# Altium schematic sheet Draft.SchDoc
size A4; Author: ALTIUM GOSTBOM2.0 KEV; SheetNumber: 2; SheetTotal: 2
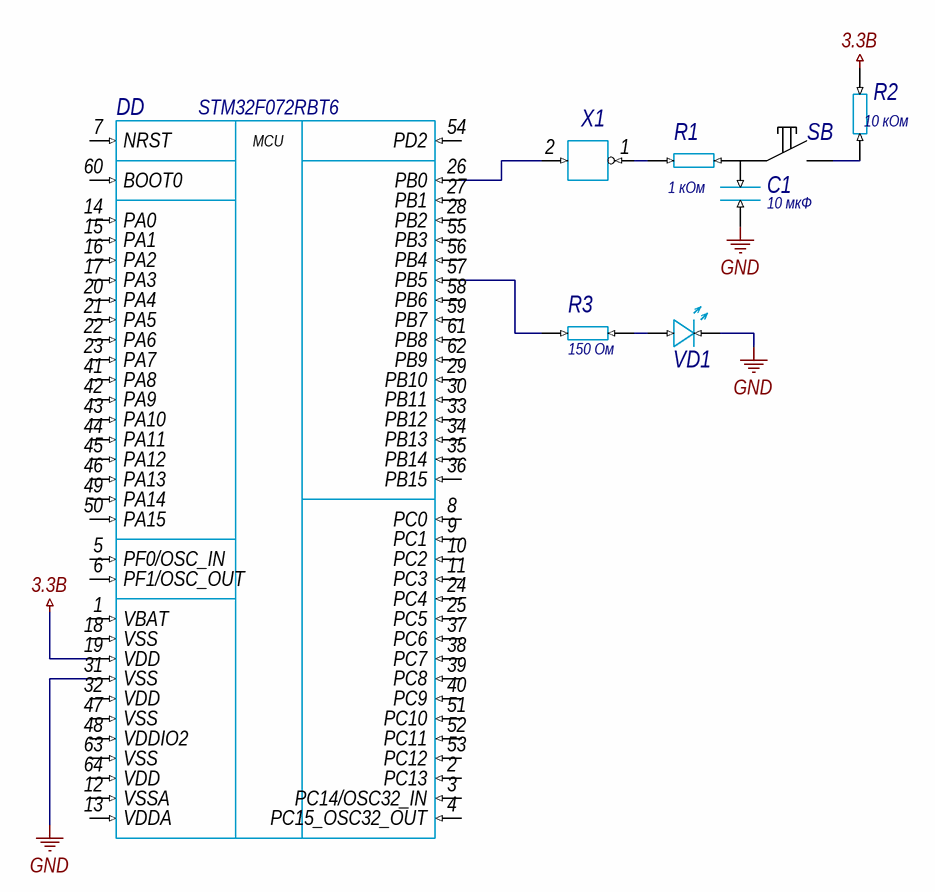
[diagram p0: Draft.SchDoc]

## Parts
C1  10 мкФ
DD  STM32F072RBT6  [STM32F072 TQFP64]
R1  1 кОм
R2  10 кОм
R3  150 Ом
SB  Кнопка замыкающая  (value not drawn)
VD1  Обозначение при заказе  (value not drawn)
X1  Обозначение при заказе  (value not drawn)

## Nets
3.3В: DD.19(VDD) R2.1
GND: C1.1 DD.31(VSS) VD1.1
NetC1_2: C1.2 R1.1
NetDD_26: DD.26(PB0) X1.2
NetDD_57: DD.57(PB5) R3.2
NetR1_2: R1.2 X1.1
NetR3_1: R3.1 VD1.2

Not connected (* = marked no-connect by the designer): DD 1(VBAT) 2(PC13) 3(PC14/OSC32_IN) 4(PC15_OSC32_OUT) 5(PF0/OSC_IN) 6(PF1/OSC_OUT) 7(NRST) 8(PC0) 9(PC1) 10(PC2) 11(PC3) 12(VSSA) 13(VDDA) 14(PA0) 15(PA1) 16(PA2) 17(PA3) 18(VSS) 20(PA4) 21(PA5) 22(PA6) 23(PA7) 24(PC4) 25(PC5) 27(PB1) 28(PB2) 29(PB10) 30(PB11) 32(VDD) 33(PB12) 34(PB13) 35(PB14) 36(PB15) 37(PC6) 38(PC7) 39(PC8) 40(PC9) 41(PA8) 42(PA9) 43(PA10) 44(PA11) 45(PA12) 46(PA13) 47(VSS) 48(VDDIO2) 49(PA14) 50(PA15) 51(PC10) 52(PC11) 53(PC12) 54(PD2) 55(PB3) 56(PB4) 58(PB6) 59(PB7) 60(BOOT0) 61(PB8) 62(PB9) 63(VSS) 64(VDD); R2 2

## Notes on the sheet
- Перв. примен.
- Справ. №
- Подп. дата
- Инв. № дубл.
- Взам. инв. №
- Подп. и дата
- Изм.
- Разраб.
- Лист
- № докум.
- Подп.
- Дата
- Лит.
- Масса
- Масштаб
- Пров.
- Т.контр.
- Листов
- Инв. № подл.
- Н.контр.
- Утв.
- ALTIUM GOSTBOM2.0 KEV
- Файл:
- Копировал
- Формат А3
- (in symbol STM32F072) MCU

## Library data of the parts
C1 = Конденсатор: Описание свойств компонента
DD = STM32F072: Описание свойств компонента
R1-R3 = Резистор: Описание свойств компонента
VD1 = Светодиод: Описание свойств компонента
X1 = Триггер Шмидта: Описание свойств компонента